# Altium schematic sheet LMS7002M_B.SchDoc
size 297 x 209 mm
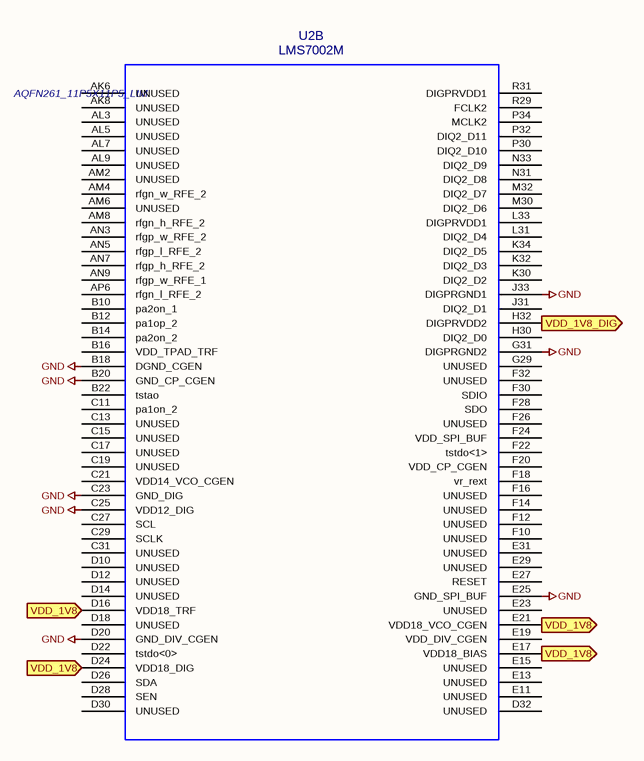
[diagram p0: LMS7002M_B.SchDoc]

## Parts
U2  LMS7002M  [AQFN261_11P5X11P5_LIM]  (part B of 3)

## Ports
VDD_1V8 (in), VDD_1V8_DIG (in)

## Nets
GND: U2.B18(DGND_CGEN) U2.B20(GND_CP_CGEN) U2.C23(GND_DIG) U2.C25(VDD12_DIG) U2.D20(GND_DIV_CGEN) U2.E25(GND_SPI_BUF) U2.G31(DIGPRGND2) U2.J33(DIGPRGND1)
VDD_1V8: U2.D16(VDD18_TRF) U2.D24(VDD18_DIG) U2.E17(VDD18_BIAS) U2.E21(VDD18_VCO_CGEN) ; port VDD_1V8
VDD_1V8_DIG: U2.H32(DIGPRVDD2) ; port VDD_1V8_DIG

Not connected (* = marked no-connect by the designer): U2 AK6(UNUSED) AK8(UNUSED) AL3(UNUSED) AL5(UNUSED) AL7(UNUSED) AL9(UNUSED) AM2(UNUSED) AM4(rfgn_w_RFE_2) AM6(UNUSED) AM8(rfgn_h_RFE_2) AN3(rfgp_w_RFE_2) AN5(rfgp_l_RFE_2) AN7(rfgp_h_RFE_2) AN9(rfgp_w_RFE_1) AP6(rfgn_l_RFE_2) B10(pa2on_1) B12(pa1op_2) B14(pa2on_2) B16(VDD_TPAD_TRF) B22(tstao) C11(pa1on_2) C13(UNUSED) C15(UNUSED) C17(UNUSED) C19(UNUSED) C21(VDD14_VCO_CGEN) C27(SCL) C29(SCLK) C31(UNUSED) D10(UNUSED) D12(UNUSED) D14(UNUSED) D18(UNUSED) D22(tstdo<0>) D26(SDA) D28(SEN) D30(UNUSED) D32(UNUSED) E11(UNUSED) E13(UNUSED) E15(UNUSED) E19(VDD_DIV_CGEN) E23(UNUSED) E27(RESET) E29(UNUSED) E31(UNUSED) F10(UNUSED) F12(UNUSED) F14(UNUSED) F16(UNUSED) F18(vr_rext) F20(VDD_CP_CGEN) F22(tstdo<1>) F24(VDD_SPI_BUF) F26(UNUSED) F28(SDO) F30(SDIO) F32(UNUSED) G29(UNUSED) H30(DIQ2_D0) J31(DIQ2_D1) K30(DIQ2_D2) K32(DIQ2_D3) K34(DIQ2_D5) L31(DIQ2_D4) L33(DIGPRVDD1) M30(DIQ2_D6) M32(DIQ2_D7) N31(DIQ2_D8) N33(DIQ2_D9) P30(DIQ2_D10) P32(DIQ2_D11) P34(MCLK2) R29(FCLK2) R31(DIGPRVDD1)

## Notes on the sheet
- 1
- 2
- 3
- 4
- 5
- 6
- A
- B
- C
- D
- Title:
- File: LMS7002M_B.kicad_sch
- Sheet: /
- KiCad E.D.A.  kicad (5.1.4)-1
- Size: A4
- Date:
- Rev:
- Id: 1/1

## Library data of the parts
U2 = LMS7002M: Value: LMS7002M